# Altium project BEAGLEPLAYV020_220915.PrjPcb (part 7 of 10)

## Sheet 014_SoC GPIO 1.8V & Bootstrap.SchDoc
size 420 x 297 mm; Page Create Date: May 29, 2006; WebSite: https://www.seeedstudio.com; Page Number: 14; Drawing: qxn; Schematic Name: BeaglePlay; Page Size: A3; Comment: Seeed Title; Page Count: 22; Page Name: 014_SoC GPIO 1.8V & Bootstrap; Company: Seeed Studio; RevCode: v0.2; DsnPath: C:\Users\a0488739\Documents\GitHub\beagleplay\allegro\DVT\BEAGLEPLAYV020_220915.DSN; SchematicName: BeaglePlay; PageName: 014_SoC GPIO 1.8V & Bootstrap; PageSize: A3; TopSchematic: True
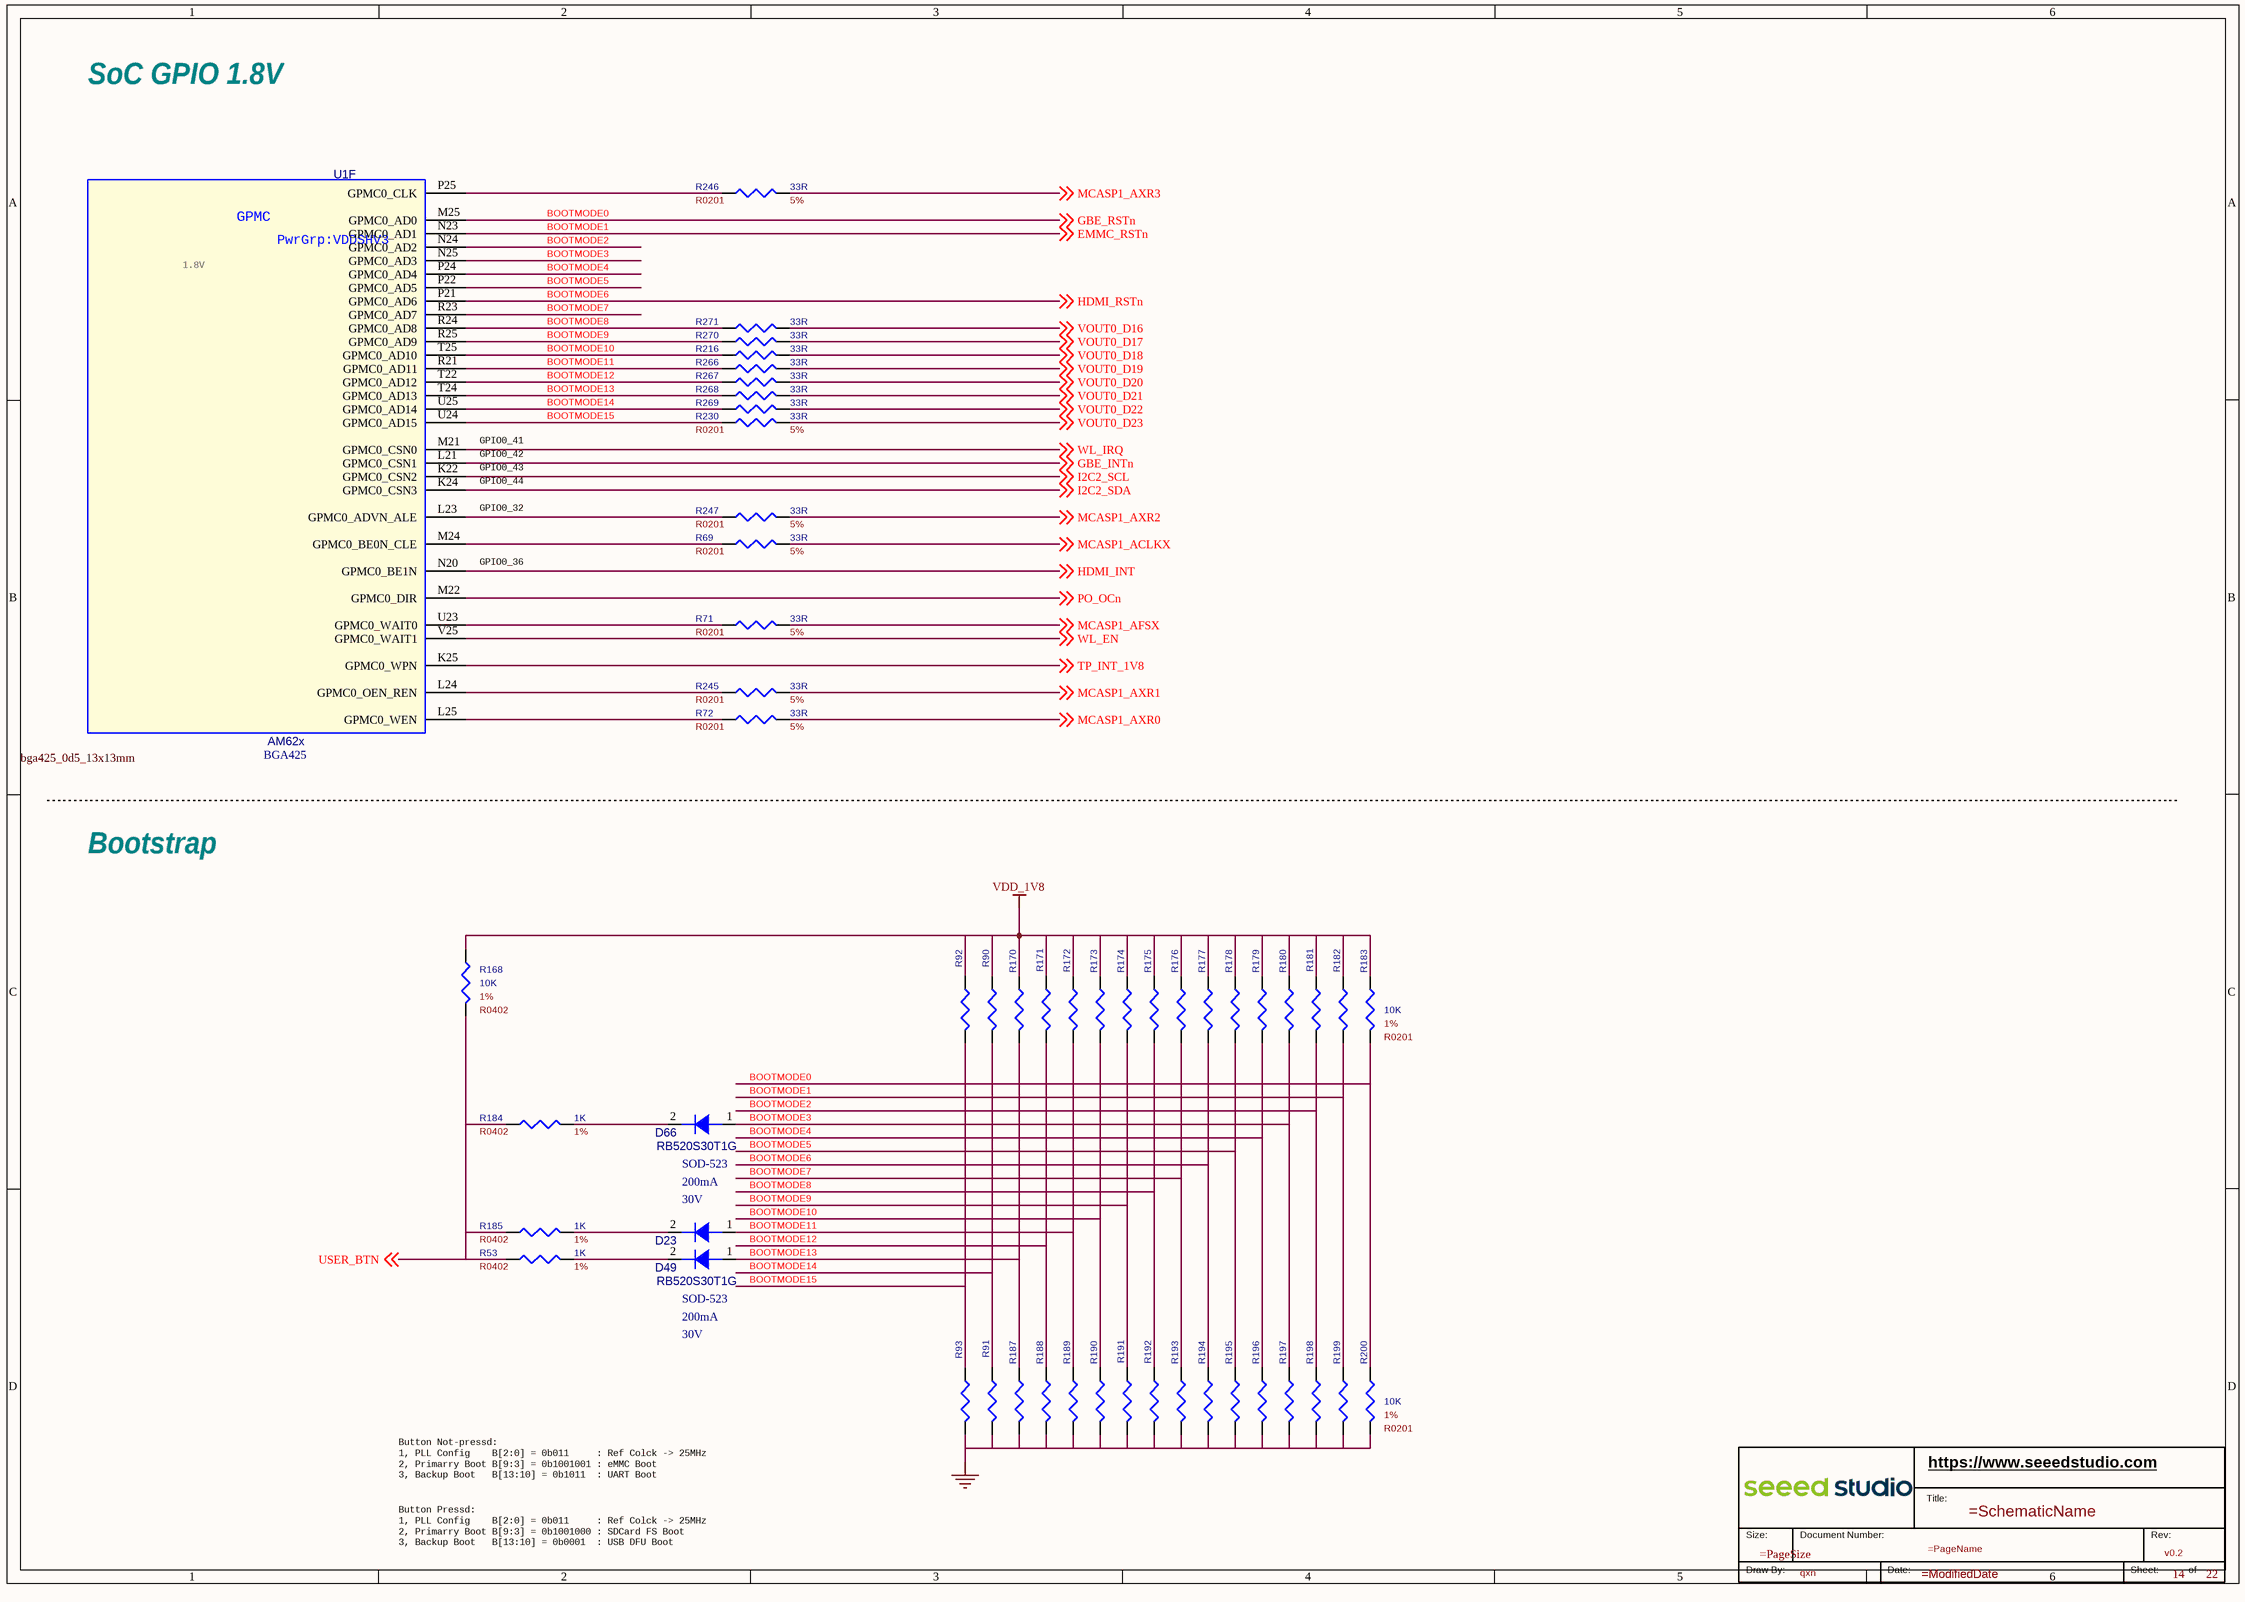
[diagram p13: 014_SoC GPIO 1.8V & Bootstrap.SchDoc]

### Parts
(Parts that share a designator on the sheet are numbered #1, #2 ... from top to bottom, then left to right.)
*#14  RevCode: v0.2  Page Number: 14  Page Count: 22  Drawing: qxn  (hidden comment: Seeed Title)  (graphical)
D23  D  [sod_523]  (value not drawn)
D49  value RB520S30T1G  Repetitive Reverse Voltage Maximum: 30V  Peak Forward Current: 200mA  Package Size: SOD-523  [sod_523]  (hidden comment: D)
D66  value RB520S30T1G  Repetitive Reverse Voltage Maximum: 30V  Peak Forward Current: 200mA  Package Size: SOD-523  [sod_523]  (hidden comment: D)
R53  value 1K  Rating: 1%  [R0402]  (hidden comment: R)
R69  value 33R  Rating: 5%  [R0201]  (hidden comment: R)
R71  value 33R  Rating: 5%  [R0201]  (hidden comment: R)
R72  value 33R  Rating: 5%  [R0201]  (hidden comment: R)
R90  R  [R0201]  (value not drawn)
R91  R  [R0201]  (value not drawn)
R92  R  [R0201]  (value not drawn)
R93  R  [R0201]  (value not drawn)
R168  value 10K  Rating: 1%  [R0402]  (hidden comment: R)
R170  R  [R0201]  (value not drawn)
R171  R  [R0201]  (value not drawn)
R172  R  [R0201]  (value not drawn)
R173  R  [R0201]  (value not drawn)
R174  R  [R0201]  (value not drawn)
R175  R  [R0201]  (value not drawn)
R176  R  [R0201]  (value not drawn)
R177  R  [R0201]  (value not drawn)
R178  R  [R0201]  (value not drawn)
R179  R  [R0201]  (value not drawn)
R180  R  [R0201]  (value not drawn)
R181  R  [R0201]  (value not drawn)
R182  R  [R0201]  (value not drawn)
R183  value 10K  Rating: 1%  [R0201]  (hidden comment: R)
R184  value 1K  Rating: 1%  [R0402]  (hidden comment: R)
R185  value 1K  Rating: 1%  [R0402]  (hidden comment: R)
R187  R  [R0201]  (value not drawn)
R188  R  [R0201]  (value not drawn)
R189  R  [R0201]  (value not drawn)
R190  R  [R0201]  (value not drawn)
R191  R  [R0201]  (value not drawn)
R192  R  [R0201]  (value not drawn)
R193  R  [R0201]  (value not drawn)
R194  R  [R0201]  (value not drawn)
R195  R  [R0201]  (value not drawn)
R196  R  [R0201]  (value not drawn)
R197  R  [R0201]  (value not drawn)
R198  R  [R0201]  (value not drawn)
R199  R  [R0201]  (value not drawn)
R200  value 10K  Rating: 1%  [R0201]  (hidden comment: R)
R216  value 33R  [R0201]  (hidden comment: R)
R230  value 33R  Rating: 5%  [R0201]  (hidden comment: R)
R245  value 33R  Rating: 5%  [R0201]  (hidden comment: R)
R246  value 33R  Rating: 5%  [R0201]  (hidden comment: R)
R247  value 33R  Rating: 5%  [R0201]  (hidden comment: R)
R266  value 33R  [R0201]  (hidden comment: R)
R267  value 33R  [R0201]  (hidden comment: R)
R268  value 33R  [R0201]  (hidden comment: R)
R269  value 33R  [R0201]  (hidden comment: R)
R270  value 33R  [R0201]  (hidden comment: R)
R271  value 33R  [R0201]  (hidden comment: R)
U1  value AM62x  Package Size: BGA425  [bga425_0d5_13x13mm]  (hidden comment: AM62x_BGA425)  (part F of 19)

### Nets
GND: R91.2 R93.2 R187.2 R188.2 R189.2 R190.2 R191.2 R192.2 R193.2 R194.2 R195.2 R196.2 R197.2 R198.2 R199.2 R200.2
VDD_1V8: R90.1 R92.1 R168.1 R170.1 R171.1 R172.1 R173.1 R174.1 R175.1 R176.1 R177.1 R178.1 R179.1 R180.1 R181.1 R182.1 R183.1
BOOTMODE0: R183.2 R200.1 U1.M25(GPMC0_AD0) ; off-sheet GBE_RSTn  [also labelled GBE_RSTn]
BOOTMODE1: R182.2 R199.1 U1.N23(GPMC0_AD1) ; off-sheet EMMC_RSTn  [also labelled EMMC_RSTn]
BOOTMODE2: R181.2 R198.1 U1.N24(GPMC0_AD2)
BOOTMODE3: D66.1(A) R180.2 R197.1 U1.N25(GPMC0_AD3)
BOOTMODE4: R179.2 R196.1 U1.P24(GPMC0_AD4)
BOOTMODE5: R178.2 R195.1 U1.P22(GPMC0_AD5)
BOOTMODE6: R177.2 R194.1 U1.P21(GPMC0_AD6) ; off-sheet HDMI_RSTn  [also labelled HDMI_RSTn]
BOOTMODE7: R176.2 R193.1 U1.R23(GPMC0_AD7)
BOOTMODE8: R175.2 R192.1 R271.1 U1.R24(GPMC0_AD8)
BOOTMODE9: R174.2 R191.1 R270.1 U1.R25(GPMC0_AD9)
BOOTMODE10: R173.2 R190.1 R216.1 U1.T25(GPMC0_AD10)
BOOTMODE11: D23.1(A) R172.2 R189.1 R266.1 U1.R21(GPMC0_AD11)
BOOTMODE12: R171.2 R188.1 R267.1 U1.T22(GPMC0_AD12)
BOOTMODE13: D49.1(A) R170.2 R187.1 R268.1 U1.T24(GPMC0_AD13)
BOOTMODE14: R90.2 R91.1 R269.1 U1.U25(GPMC0_AD14)
BOOTMODE15: R92.2 R93.1 R230.1 U1.U24(GPMC0_AD15)
GBE_INTn: U1.L21(GPMC0_CSN1) ; off-sheet GBE_INTn
HDMI_INT: U1.N20(GPMC0_BE1N) ; off-sheet HDMI_INT
I2C2_SCL: U1.K22(GPMC0_CSN2) ; off-sheet I2C2_SCL
I2C2_SDA: U1.K24(GPMC0_CSN3) ; off-sheet I2C2_SDA
MCASP1_ACLKX: R69.2 ; off-sheet MCASP1_ACLKX
MCASP1_AFSX: R71.2 ; off-sheet MCASP1_AFSX
MCASP1_AXR0: R72.2 ; off-sheet MCASP1_AXR0
MCASP1_AXR1: R245.2 ; off-sheet MCASP1_AXR1
MCASP1_AXR2: R247.2 ; off-sheet MCASP1_AXR2
MCASP1_AXR3: R246.2 ; off-sheet MCASP1_AXR3
PO_OCn: U1.M22(GPMC0_DIR) ; off-sheet PO_OCn
TP_INT_1V8: U1.K25(GPMC0_WPN) ; off-sheet TP_INT_1V8
USER_BTN: R53.1 R168.2 R184.1 R185.1 ; off-sheet USER_BTN
VOUT0_D16: R271.2 ; off-sheet VOUT0_D16
VOUT0_D17: R270.2 ; off-sheet VOUT0_D17
VOUT0_D18: R216.2 ; off-sheet VOUT0_D18
VOUT0_D19: R266.2 ; off-sheet VOUT0_D19
VOUT0_D20: R267.2 ; off-sheet VOUT0_D20
VOUT0_D21: R268.2 ; off-sheet VOUT0_D21
VOUT0_D22: R269.2 ; off-sheet VOUT0_D22
VOUT0_D23: R230.2 ; off-sheet VOUT0_D23
WL_EN: U1.V25(GPMC0_WAIT1) ; off-sheet WL_EN
WL_IRQ: U1.M21(GPMC0_CSN0) ; off-sheet WL_IRQ
NetD23_2: D23.2(C) R185.2
NetD49_2: D49.2(C) R53.2
NetD66_2: D66.2(C) R184.2
NetR69_1: R69.1 U1.M24(GPMC0_BE0N_CLE)
NetR71_1: R71.1 U1.U23(GPMC0_WAIT0)
NetR72_1: R72.1 U1.L25(GPMC0_WEN)
NetR245_1: R245.1 U1.L24(GPMC0_OEN_REN)
NetR246_1: R246.1 U1.P25(GPMC0_CLK)
NetR247_1: R247.1 U1.L23(GPMC0_ADVN_ALE)

### Notes on the sheet
- SoC GPIO 1.8V
- 1.8V
- GPIO0_42
- GPIO0_41
- GPIO0_43
- GPIO0_44
- GPIO0_32
- GPIO0_36
- Bootstrap
- Button Not-pressd:
  1, PLL Config    B[2:0] = 0b011     : Ref Colck -> 25MHz
  2, Primarry Boot B[9:3] = 0b1001001 : eMMC Boot
  3, Backup Boot   B[13:10] = 0b1011  : UART Boot
- Button Pressd:
  1, PLL Config    B[2:0] = 0b011     : Ref Colck -> 25MHz
  2, Primarry Boot B[9:3] = 0b1001000 : SDCard FS Boot
  3, Backup Boot   B[13:10] = 0b0001  : USB DFU Boot
- (in symbol AM62x_BGA425, part F) GPMC; PwrGrp:VDDSHV3
- (in symbol Seeed Title) https://www.seeedstudio.com; Title:; Size:; Document Number:; Rev:; Draw By:; Date:; Sheet:; of

### Library data of the parts
*#14 = Seeed Title: Company: Seeed Studio; WebSite: https://www.seeedstudio.com; Schematic Name: =SchematicName; Page Size: =PageSize; Page Name: =PageName; Page Create Date: May 29, 2006; Page Modify Date: =ModifiedDate
D23 = D: DIO, Schottky, RB520S30T1G, , , , SOD-523; Part Reference: D23; Company Part Status: SCG Vehicle Device; Manufacturer: ON; PN: 304020782; Peak Forward Current: 200mA; Repetitive Reverse Voltage Maximum: 30V; CLASS: DISCRETE; PCB Footprint: sod_523; Value: RB520S30T1G; Package Size: SOD-523; Manufacturer PN: RB520S30T1G
D49 = D: DIO, Schottky, RB520S30T1G, , , , SOD-523; Part Reference: D49; Manufacturer: ON; Company Part Status: SCG Vehicle Device; CLASS: DISCRETE; PN: 304020782; PCB Footprint: sod_523; Manufacturer PN: RB520S30T1G
D66 = D: DIO, Schottky, RB520S30T1G, , , , SOD-523; Part Reference: D66; Manufacturer: ON; Company Part Status: SCG Vehicle Device; CLASS: DISCRETE; PN: 304020782; PCB Footprint: sod_523; Manufacturer PN: RB520S30T1G
R53 = R: RES, Thick Film, 1K, 1%, 1/16W, SMD, 0402; Part Reference: R53; Manufacturer PN: RC0402FR-071KL; Manufacturer: YAGEO; Company Part Status: Combox Pro; CLASS: DISCRETE; PN: 301010044; PCB Footprint: R0402; Rated Power: 1/16W; Package Size: 0402
R69 = R: RES, Thick Film, 33R, 5%, 1/20W, SMD, 0201; Part Reference: R69; Manufacturer PN: RC0201JR-0733RL; Manufacturer: YAGEO; Company Part Status: BeagleBone Carrier Board; CLASS: DISCRETE; PN: 301010675; PCB Footprint: R0201; Rated Power: 1/20W; Package Size: 0201
R71 = R: RES, Thick Film, 33R, 5%, 1/20W, SMD, 0201; Part Reference: R71; Manufacturer PN: RC0201JR-0733RL; Manufacturer: YAGEO; Company Part Status: BeagleBone Carrier Board; CLASS: DISCRETE; PN: 301010675; PCB Footprint: R0201; Rated Power: 1/20W; Package Size: 0201
R72 = R: RES, Thick Film, 33R, 5%, 1/20W, SMD, 0201; Part Reference: R72; Manufacturer PN: RC0201JR-0733RL; Manufacturer: YAGEO; Company Part Status: BeagleBone Carrier Board; CLASS: DISCRETE; PN: 301010675; PCB Footprint: R0201; Rated Power: 1/20W; Package Size: 0201
R90 = R: RES, Thick Film, 10K, 1%, 1/20W, SMD, 0201; Part Reference: R90; Manufacturer PN: RC0201FR-0710KL; Manufacturer: YAGEO; Company Part Status: RV PI; CLASS: DISCRETE; PN: 301010526; Rating: 1%; PCB Footprint: R0201; Value: 10K; Package Size: 0201; Rated Power: 1/20W
R91 = R: RES, Thick Film, 10K, 1%, 1/20W, SMD, 0201; Part Reference: R91; Company Part Status: RV PI; Manufacturer: YAGEO; Manufacturer PN: RC0201FR-0710KL; PN: 301010526; CLASS: DISCRETE; Rating: 1%; PCB Footprint: R0201; Value: 10K; Package Size: 0201; Rated Power: 1/20W
R92 = R: RES, Thick Film, 10K, 1%, 1/20W, SMD, 0201; Part Reference: R92; Company Part Status: RV PI; Manufacturer: YAGEO; Manufacturer PN: RC0201FR-0710KL; PN: 301010526; CLASS: DISCRETE; Rating: 1%; PCB Footprint: R0201; Value: 10K; Rated Power: 1/20W; Package Size: 0201
R93 = R: RES, Thick Film, 10K, 1%, 1/20W, SMD, 0201; Part Reference: R93; Manufacturer PN: RC0201FR-0710KL; Manufacturer: YAGEO; Company Part Status: RV PI; CLASS: DISCRETE; PN: 301010526; Rating: 1%; PCB Footprint: R0201; Value: 10K; Rated Power: 1/20W; Package Size: 0201
R168 = R: RES, Thick Film, 10K, 1%, 1/16W, SMD, 0402; Part Reference: R168; Company Part Status: BeagleBone Carrier Board; Manufacturer: YAGEO; Manufacturer PN: RC0402FR-0710KL; PN: 301010047; CLASS: DISCRETE; PCB Footprint: R0402; Package Size: 0402; Rated Power: 1/16W
R170 = R: RES, Thick Film, 10K, 1%, 1/20W, SMD, 0201; Part Reference: R170; Manufacturer PN: RC0201FR-0710KL; Manufacturer: YAGEO; Company Part Status: RV PI; CLASS: DISCRETE; PN: 301010526; Rating: 1%; PCB Footprint: R0201; Value: 10K; Package Size: 0201; Rated Power: 1/20W
R171 = R: RES, Thick Film, 10K, 1%, 1/20W, SMD, 0201; Part Reference: R171; Manufacturer PN: RC0201FR-0710KL; Manufacturer: YAGEO; Company Part Status: RV PI; CLASS: DISCRETE; PN: 301010526; Rating: 1%; PCB Footprint: R0201; Value: 10K; Package Size: 0201; Rated Power: 1/20W
R172 = R: RES, Thick Film, 10K, 1%, 1/20W, SMD, 0201; Part Reference: R172; Manufacturer PN: RC0201FR-0710KL; Manufacturer: YAGEO; Company Part Status: RV PI; CLASS: DISCRETE; PN: 301010526; Rating: 1%; PCB Footprint: R0201; Value: 10K; Package Size: 0201; Rated Power: 1/20W
R173 = R: RES, Thick Film, 10K, 1%, 1/20W, SMD, 0201; Part Reference: R173; Manufacturer PN: RC0201FR-0710KL; Manufacturer: YAGEO; Company Part Status: RV PI; CLASS: DISCRETE; PN: 301010526; Rating: 1%; PCB Footprint: R0201; Value: 10K; Package Size: 0201; Rated Power: 1/20W
R174 = R: RES, Thick Film, 10K, 1%, 1/20W, SMD, 0201; Part Reference: R174; Manufacturer PN: RC0201FR-0710KL; Manufacturer: YAGEO; Company Part Status: RV PI; CLASS: DISCRETE; PN: 301010526; Rating: 1%; PCB Footprint: R0201; Value: 10K; Package Size: 0201; Rated Power: 1/20W
R175 = R: RES, Thick Film, 10K, 1%, 1/20W, SMD, 0201; Part Reference: R175; Manufacturer PN: RC0201FR-0710KL; Manufacturer: YAGEO; Company Part Status: RV PI; CLASS: DISCRETE; PN: 301010526; Rating: 1%; PCB Footprint: R0201; Value: 10K; Package Size: 0201; Rated Power: 1/20W
R176 = R: RES, Thick Film, 10K, 1%, 1/20W, SMD, 0201; Part Reference: R176; Manufacturer PN: RC0201FR-0710KL; Manufacturer: YAGEO; Company Part Status: RV PI; CLASS: DISCRETE; PN: 301010526; Rating: 1%; PCB Footprint: R0201; Value: 10K; Package Size: 0201; Rated Power: 1/20W
R177 = R: RES, Thick Film, 10K, 1%, 1/20W, SMD, 0201; Part Reference: R177; Manufacturer PN: RC0201FR-0710KL; Manufacturer: YAGEO; Company Part Status: RV PI; CLASS: DISCRETE; PN: 301010526; Rating: 1%; PCB Footprint: R0201; Value: 10K; Package Size: 0201; Rated Power: 1/20W
R178 = R: RES, Thick Film, 10K, 1%, 1/20W, SMD, 0201; Part Reference: R178; Manufacturer PN: RC0201FR-0710KL; Manufacturer: YAGEO; Company Part Status: RV PI; CLASS: DISCRETE; PN: 301010526; Rating: 1%; PCB Footprint: R0201; Value: 10K; Package Size: 0201; Rated Power: 1/20W
R179 = R: RES, Thick Film, 10K, 1%, 1/20W, SMD, 0201; Part Reference: R179; Manufacturer PN: RC0201FR-0710KL; Manufacturer: YAGEO; Company Part Status: RV PI; CLASS: DISCRETE; PN: 301010526; Rating: 1%; PCB Footprint: R0201; Value: 10K; Package Size: 0201; Rated Power: 1/20W
R180 = R: RES, Thick Film, 10K, 1%, 1/20W, SMD, 0201; Part Reference: R180; Manufacturer PN: RC0201FR-0710KL; Manufacturer: YAGEO; Company Part Status: RV PI; CLASS: DISCRETE; PN: 301010526; Rating: 1%; PCB Footprint: R0201; Value: 10K; Package Size: 0201; Rated Power: 1/20W
R181 = R: RES, Thick Film, 10K, 1%, 1/20W, SMD, 0201; Part Reference: R181; Manufacturer PN: RC0201FR-0710KL; Manufacturer: YAGEO; Company Part Status: RV PI; CLASS: DISCRETE; PN: 301010526; Rating: 1%; PCB Footprint: R0201; Value: 10K; Package Size: 0201; Rated Power: 1/20W
R182 = R: RES, Thick Film, 10K, 1%, 1/20W, SMD, 0201; Part Reference: R182; Manufacturer PN: RC0201FR-0710KL; Manufacturer: YAGEO; Company Part Status: RV PI; CLASS: DISCRETE; PN: 301010526; Rating: 1%; PCB Footprint: R0201; Value: 10K; Package Size: 0201; Rated Power: 1/20W
R183 = R: RES, Thick Film, 10K, 1%, 1/20W, SMD, 0201; Part Reference: R183; Company Part Status: RV PI; Manufacturer: YAGEO; Manufacturer PN: RC0201FR-0710KL; PN: 301010526; CLASS: DISCRETE; PCB Footprint: R0201; Package Size: 0201; Rated Power: 1/20W
R184 = R: RES, Thick Film, 1K, 1%, 1/16W, SMD, 0402; Part Reference: R184; Manufacturer PN: RC0402FR-071KL; Manufacturer: YAGEO; Company Part Status: Combox Pro; CLASS: DISCRETE; PN: 301010044; PCB Footprint: R0402; Rated Power: 1/16W; Package Size: 0402
R185 = R: RES, Thick Film, 1K, 1%, 1/16W, SMD, 0402; Part Reference: R185; Manufacturer PN: RC0402FR-071KL; Manufacturer: YAGEO; Company Part Status: Combox Pro; CLASS: DISCRETE; PN: 301010044; PCB Footprint: R0402; Rated Power: 1/16W; Package Size: 0402
R187 = R: RES, Thick Film, 10K, 1%, 1/20W, SMD, 0201; Part Reference: R187; Company Part Status: RV PI; Manufacturer: YAGEO; Manufacturer PN: RC0201FR-0710KL; PN: 301010526; CLASS: DISCRETE; Rating: 1%; PCB Footprint: R0201; Value: 10K; Package Size: 0201; Rated Power: 1/20W
R188 = R: RES, Thick Film, 10K, 1%, 1/20W, SMD, 0201; Part Reference: R188; Company Part Status: RV PI; Manufacturer: YAGEO; Manufacturer PN: RC0201FR-0710KL; PN: 301010526; CLASS: DISCRETE; Rating: 1%; PCB Footprint: R0201; Value: 10K; Package Size: 0201; Rated Power: 1/20W
R189 = R: RES, Thick Film, 10K, 1%, 1/20W, SMD, 0201; Part Reference: R189; Company Part Status: RV PI; Manufacturer: YAGEO; Manufacturer PN: RC0201FR-0710KL; PN: 301010526; CLASS: DISCRETE; Rating: 1%; PCB Footprint: R0201; Value: 10K; Package Size: 0201; Rated Power: 1/20W
R190 = R: RES, Thick Film, 10K, 1%, 1/20W, SMD, 0201; Part Reference: R190; Company Part Status: RV PI; Manufacturer: YAGEO; Manufacturer PN: RC0201FR-0710KL; PN: 301010526; CLASS: DISCRETE; Rating: 1%; PCB Footprint: R0201; Value: 10K; Package Size: 0201; Rated Power: 1/20W
R191 = R: RES, Thick Film, 10K, 1%, 1/20W, SMD, 0201; Part Reference: R191; Company Part Status: RV PI; Manufacturer: YAGEO; Manufacturer PN: RC0201FR-0710KL; PN: 301010526; CLASS: DISCRETE; Rating: 1%; PCB Footprint: R0201; Value: 10K; Package Size: 0201; Rated Power: 1/20W
R192 = R: RES, Thick Film, 10K, 1%, 1/20W, SMD, 0201; Part Reference: R192; Company Part Status: RV PI; Manufacturer: YAGEO; Manufacturer PN: RC0201FR-0710KL; PN: 301010526; CLASS: DISCRETE; Rating: 1%; PCB Footprint: R0201; Value: 10K; Package Size: 0201; Rated Power: 1/20W
R193 = R: RES, Thick Film, 10K, 1%, 1/20W, SMD, 0201; Part Reference: R193; Company Part Status: RV PI; Manufacturer: YAGEO; Manufacturer PN: RC0201FR-0710KL; PN: 301010526; CLASS: DISCRETE; Rating: 1%; PCB Footprint: R0201; Value: 10K; Package Size: 0201; Rated Power: 1/20W
R194 = R: RES, Thick Film, 10K, 1%, 1/20W, SMD, 0201; Part Reference: R194; Company Part Status: RV PI; Manufacturer: YAGEO; Manufacturer PN: RC0201FR-0710KL; PN: 301010526; CLASS: DISCRETE; Rating: 1%; PCB Footprint: R0201; Value: 10K; Package Size: 0201; Rated Power: 1/20W
R195 = R: RES, Thick Film, 10K, 1%, 1/20W, SMD, 0201; Part Reference: R195; Company Part Status: RV PI; Manufacturer: YAGEO; Manufacturer PN: RC0201FR-0710KL; PN: 301010526; CLASS: DISCRETE; Rating: 1%; PCB Footprint: R0201; Value: 10K; Package Size: 0201; Rated Power: 1/20W
R196 = R: RES, Thick Film, 10K, 1%, 1/20W, SMD, 0201; Part Reference: R196; Company Part Status: RV PI; Manufacturer: YAGEO; Manufacturer PN: RC0201FR-0710KL; PN: 301010526; CLASS: DISCRETE; Rating: 1%; PCB Footprint: R0201; Value: 10K; Package Size: 0201; Rated Power: 1/20W
R197 = R: RES, Thick Film, 10K, 1%, 1/20W, SMD, 0201; Part Reference: R197; Company Part Status: RV PI; Manufacturer: YAGEO; Manufacturer PN: RC0201FR-0710KL; PN: 301010526; CLASS: DISCRETE; Rating: 1%; PCB Footprint: R0201; Value: 10K; Package Size: 0201; Rated Power: 1/20W
R198 = R: RES, Thick Film, 10K, 1%, 1/20W, SMD, 0201; Part Reference: R198; Company Part Status: RV PI; Manufacturer: YAGEO; Manufacturer PN: RC0201FR-0710KL; PN: 301010526; CLASS: DISCRETE; Rating: 1%; PCB Footprint: R0201; Value: 10K; Package Size: 0201; Rated Power: 1/20W
R199 = R: RES, Thick Film, 10K, 1%, 1/20W, SMD, 0201; Part Reference: R199; Company Part Status: RV PI; Manufacturer: YAGEO; Manufacturer PN: RC0201FR-0710KL; PN: 301010526; CLASS: DISCRETE; Rating: 1%; PCB Footprint: R0201; Value: 10K; Package Size: 0201; Rated Power: 1/20W
R200 = R: RES, Thick Film, 10K, 1%, 1/20W, SMD, 0201; Part Reference: R200; Manufacturer PN: RC0201FR-0710KL; Manufacturer: YAGEO; Company Part Status: RV PI; CLASS: DISCRETE; PN: 301010526; PCB Footprint: R0201; Package Size: 0201; Rated Power: 1/20W
R216 = R: RES, Thick Film, 33R, 5%, 1/20W, SMD, 0201; Part Reference: R216; Manufacturer PN: RC0201JR-0733RL; Manufacturer: YAGEO; Company Part Status: BeagleBone Carrier Board; CLASS: DISCRETE; PN: 301010675; Rating: 5%; PCB Footprint: R0201; Rated Power: 1/20W; Package Size: 0201
R230 = R: RES, Thick Film, 33R, 5%, 1/20W, SMD, 0201; Part Reference: R230; Manufacturer PN: RC0201JR-0733RL; Manufacturer: YAGEO; Company Part Status: BeagleBone Carrier Board; CLASS: DISCRETE; PN: 301010675; PCB Footprint: R0201; Rated Power: 1/20W; Package Size: 0201
R245 = R: RES, Thick Film, 33R, 5%, 1/20W, SMD, 0201; Part Reference: R245; Manufacturer PN: RC0201JR-0733RL; Manufacturer: YAGEO; Company Part Status: BeagleBone Carrier Board; CLASS: DISCRETE; PN: 301010675; PCB Footprint: R0201; Rated Power: 1/20W; Package Size: 0201
R246 = R: RES, Thick Film, 33R, 5%, 1/20W, SMD, 0201; Part Reference: R246; Manufacturer PN: RC0201JR-0733RL; Manufacturer: YAGEO; Company Part Status: BeagleBone Carrier Board; CLASS: DISCRETE; PN: 301010675; PCB Footprint: R0201; Rated Power: 1/20W; Package Size: 0201
R247 = R: RES, Thick Film, 33R, 5%, 1/20W, SMD, 0201; Part Reference: R247; Manufacturer PN: RC0201JR-0733RL; Manufacturer: YAGEO; Company Part Status: BeagleBone Carrier Board; CLASS: DISCRETE; PN: 301010675; PCB Footprint: R0201; Rated Power: 1/20W; Package Size: 0201
R266 = R: RES, Thick Film, 33R, 5%, 1/20W, SMD, 0201; Part Reference: R266; Manufacturer PN: RC0201JR-0733RL; Manufacturer: YAGEO; Company Part Status: BeagleBone Carrier Board; CLASS: DISCRETE; PN: 301010675; Rating: 5%; PCB Footprint: R0201; Rated Power: 1/20W; Package Size: 0201
R267 = R: RES, Thick Film, 33R, 5%, 1/20W, SMD, 0201; Part Reference: R267; Manufacturer PN: RC0201JR-0733RL; Manufacturer: YAGEO; Company Part Status: BeagleBone Carrier Board; CLASS: DISCRETE; PN: 301010675; Rating: 5%; PCB Footprint: R0201; Rated Power: 1/20W; Package Size: 0201
R268 = R: RES, Thick Film, 33R, 5%, 1/20W, SMD, 0201; Part Reference: R268; Manufacturer PN: RC0201JR-0733RL; Manufacturer: YAGEO; Company Part Status: BeagleBone Carrier Board; CLASS: DISCRETE; PN: 301010675; Rating: 5%; PCB Footprint: R0201; Rated Power: 1/20W; Package Size: 0201
R269 = R: RES, Thick Film, 33R, 5%, 1/20W, SMD, 0201; Part Reference: R269; Manufacturer PN: RC0201JR-0733RL; Manufacturer: YAGEO; Company Part Status: BeagleBone Carrier Board; CLASS: DISCRETE; PN: 301010675; Rating: 5%; PCB Footprint: R0201; Rated Power: 1/20W; Package Size: 0201
R270 = R: RES, Thick Film, 33R, 5%, 1/20W, SMD, 0201; Part Reference: R270; Manufacturer PN: RC0201JR-0733RL; Manufacturer: YAGEO; Company Part Status: BeagleBone Carrier Board; CLASS: DISCRETE; PN: 301010675; Rating: 5%; PCB Footprint: R0201; Rated Power: 1/20W; Package Size: 0201
R271 = R: RES, Thick Film, 33R, 5%, 1/20W, SMD, 0201; Part Reference: R271; Manufacturer PN: RC0201JR-0733RL; Manufacturer: YAGEO; Company Part Status: BeagleBone Carrier Board; CLASS: DISCRETE; PN: 301010675; Rating: 5%; PCB Footprint: R0201; Rated Power: 1/20W; Package Size: 0201
U1 = AM62x_BGA425: IC, Controller, MPU, AM62x, BGA425; Part Reference: U1; Company Part Status: BeaglePlay; Manufacturer: TI; Manufacturer PN: AM6254ATCGGHALWR; PN: 310011537; PCB Footprint: bga425_0d5_13x13mm; CLASS: IC

## Sheet 015_SoC USB & USB_A & USB_C.SchDoc
size 420 x 297 mm; Page Create Date: May 29, 2006; WebSite: https://www.seeedstudio.com; Variant Name: <Core Design>; Page Number: 15; Drawing: qxn; Schematic Name: BeaglePlay; Page Size: A3; Comment: Seeed Title; Page Count: 22; Page Name: 015_SoC USB & USB_A & USB_C; Company: Seeed Studio; RevCode: v0.2; DsnPath: C:\Users\a0488739\Documents\GitHub\beagleplay\allegro\DVT\BEAGLEPLAYV020_220915.DSN; SchematicName: BeaglePlay; PageName: 015_SoC USB & USB_A & USB_C; PageSize: A3; TopSchematic: True
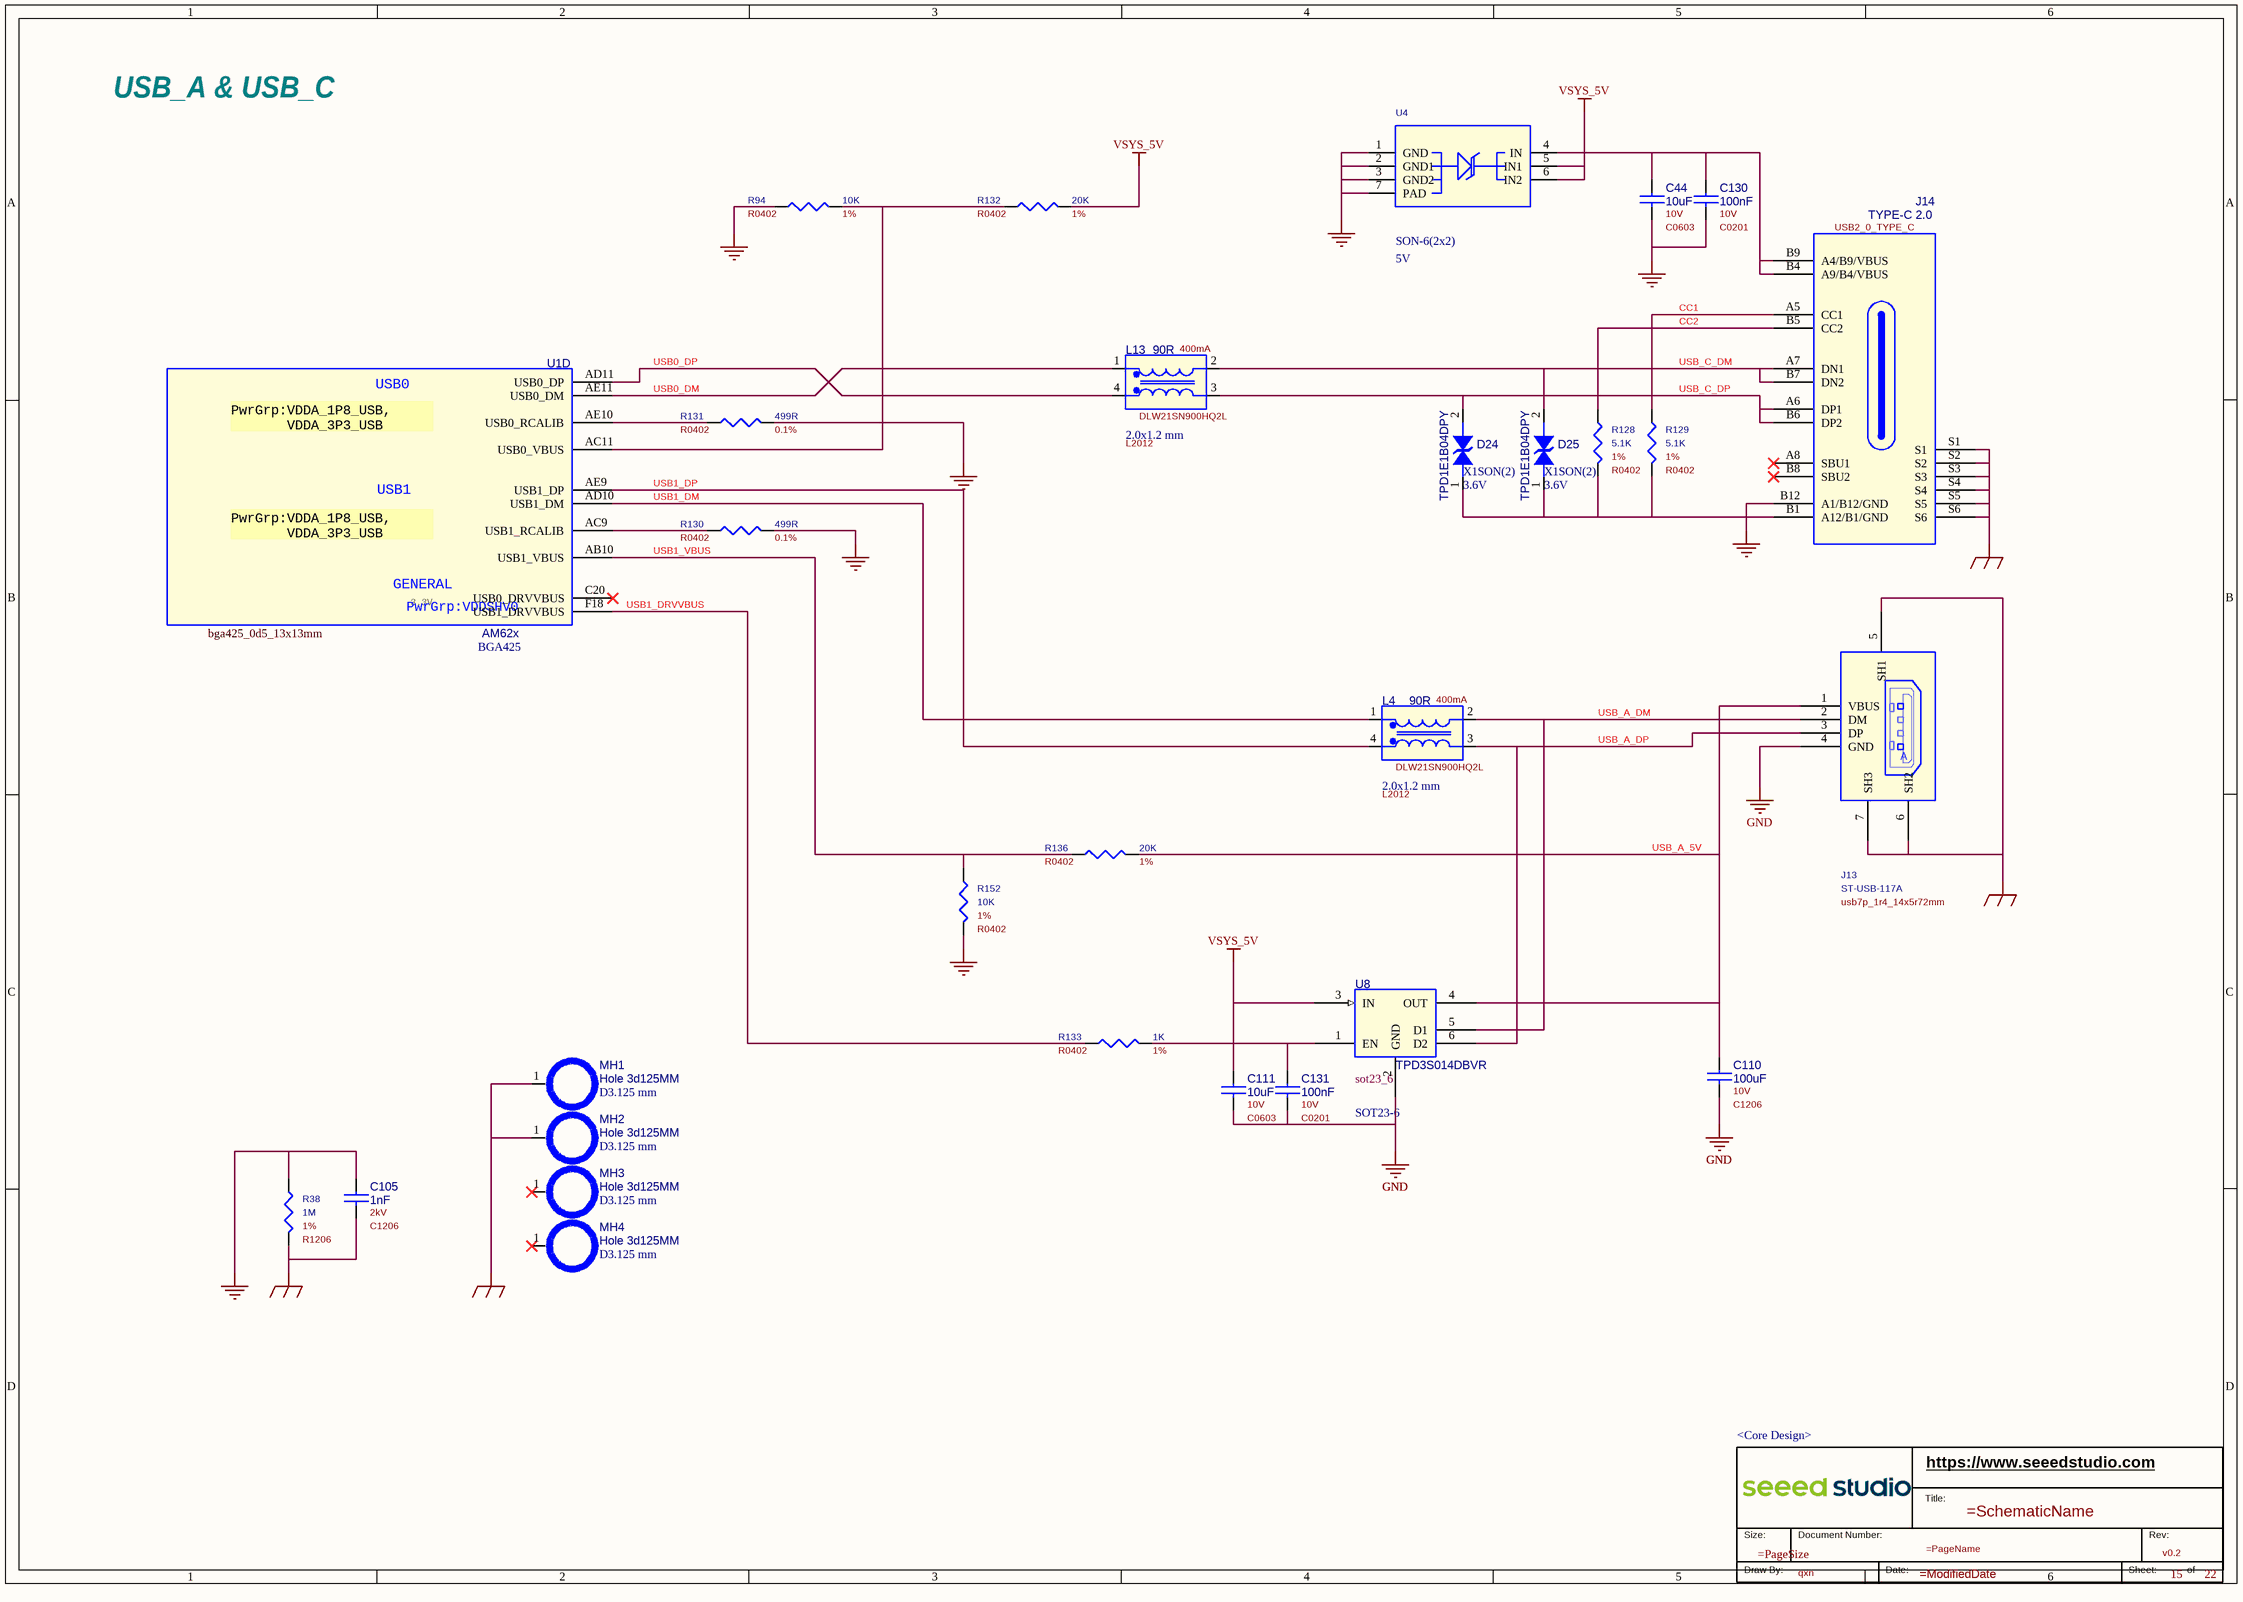
[diagram p14: 015_SoC USB & USB_A & USB_C.SchDoc]

### Parts
(Parts that share a designator on the sheet are numbered #1, #2 ... from top to bottom, then left to right.)
*#15  RevCode: v0.2  Page Number: 15  Page Count: 22  Drawing: qxn  Variant Name: <Core Design>  (hidden comment: Seeed Title)  (graphical)
C44  value 10uF  Rating: 10V  [C0603]  (hidden comment: CC)
C105  value 1nF  Rating: 2kV  [C1206]  (hidden comment: CC)
C110  value 100uF  Rating: 10V  [C1206]  (hidden comment: CC)
C111  value 10uF  Rating: 10V  [C0603]  (hidden comment: CC)
C130  value 100nF  Rating: 10V  [C0201]  (hidden comment: CC)
C131  value 100nF  Rating: 10V  [C0201]  (hidden comment: CC)
D24  value TPD1E1B04DPY  Package Size: X1SON(2)  Rated Voltage: 3.6V  [D0402]  (hidden comment: DIODE TVS BI-DIR)
D25  value TPD1E1B04DPY  Package Size: X1SON(2)  Rated Voltage: 3.6V  [D0402]  (hidden comment: DIODE TVS BI-DIR)
J13  value ST-USB-117A  PCB Footprint: usb7p_1r4_14x5r72mm  [CON_USBDUAL72309]  (hidden comment: Single USB A_180D)
J14  value TYPE-C 2.0  [USB2_0_TYPE_C]  (hidden comment: USB2.0_Type C_16+6P#1)
L4  value 90R  Manufacturer Part Number: DLW21SN900HQ2L  Rating: 400mA  Package Size: 2.0x1.2 mm  [L2012]  (hidden comment: CL)
L13  value 90R  Manufacturer Part Number: DLW21SN900HQ2L  Rating: 400mA  Package Size: 2.0x1.2 mm  [L2012]  (hidden comment: CL)
MH1  value Hole 3d125MM  Package Size: D3.125 mm  [PTH_3_125mm_5]  (hidden comment: MHole)
MH2  value Hole 3d125MM  Package Size: D3.125 mm  [PTH_3_125mm_5]  (hidden comment: MHole)
MH3  value Hole 3d125MM  Package Size: D3.125 mm  [PTH_3_125mm_5]  (hidden comment: MHole)
MH4  value Hole 3d125MM  Package Size: D3.125 mm  [PTH_3_125mm_5]  (hidden comment: MHole)
R38  value 1M  Rating: 1%  [R1206]  (hidden comment: R)
R94  value 10K  Rating: 1%  [R0402]  (hidden comment: R)
R128  value 5.1K  Rating: 1%  [R0402]  (hidden comment: R)
R129  value 5.1K  Rating: 1%  [R0402]  (hidden comment: R)
R130  value 499R  Rating: 0.1%  [R0402]  (hidden comment: R)
R131  value 499R  Rating: 0.1%  [R0402]  (hidden comment: R)
R132  value 20K  Rating: 1%  [R0402]  (hidden comment: R)
R133  value 1K  Rating: 1%  [R0402]  (hidden comment: R)
R136  value 20K  Rating: 1%  [R0402]  (hidden comment: R)
R152  value 10K  Rating: 1%  [R0402]  (hidden comment: R)
U1  value AM62x  Package Size: BGA425  [bga425_0d5_13x13mm]  (hidden comment: AM62x_BGA425)  (part D of 19)
U4  Package Size: SON-6(2x2)  Rated Voltage: 5V  [WSON6_0d65_2x2x0_8mm]  (hidden comment: TVS0500DRVR)
U8  value TPD3S014DBVR  Package Size: SOT23-6  [sot23_6]  (hidden comment: TPD3S014D_SOT23-6)

### Nets
GND: C44.2 C105.1 C110.2 C111.2 C130.2 C131.2 D24.1 D25.1 J13.4(GND) J14.B1(A12/B1/GND) J14.B12(A1/B12/GND) R38.1 R94.1 R128.2 R129.2 R130.2 R131.2 R152.2 U4.1(GND) U4.2(GND1) U4.3(GND2) U4.7(PAD) U8.2(GND)
GND_EARTH: C105.2 J13.5(SH1) J13.6(SH2) J13.7(SH3) J14.S1 J14.S2 J14.S3 J14.S4 J14.S5 J14.S6 MH1.1(NC) MH2.1(NC) R38.2
VSYS_5V: C44.1 C111.1 C130.1 J14.B4(A9/B4/VBUS) J14.B9(A4/B9/VBUS) R132.2 U4.4(IN) U4.5(IN1) U4.6(IN2) U8.3(IN)
CC1: J14.A5(CC1) R129.1
CC2: J14.B5(CC2) R128.1
USB0_DM: L13.1 U1.AE11(USB0_DM)
USB0_DP: L13.4 U1.AD11(USB0_DP)
USB1_DM: L4.1 U1.AD10(USB1_DM)
USB1_DP: L4.4 U1.AE9(USB1_DP)
USB1_DRVVBUS: R133.1 U1.F18(USB1_DRVVBUS)
USB1_VBUS: R136.1 R152.1 U1.AB10(USB1_VBUS)
USB_A_5V: C110.1 J13.1(VBUS) R136.2 U8.4(OUT)
USB_A_DM: J13.2(DM) L4.2 U8.5(D1)
USB_A_DP: J13.3(DP) L4.3 U8.6(D2)
USB_C_DM: D25.2 J14.A7(DN1) J14.B7(DN2) L13.2
USB_C_DP: D24.2 J14.A6(DP1) J14.B6(DP2) L13.3
NetC131_1: C131.1 R133.2 U8.1(EN)
NetR94_2: R94.2 R132.1 U1.AC11(USB0_VBUS)
NetR130_1: R130.1 U1.AC9(USB1_RCALIB)
NetR131_1: R131.1 U1.AE10(USB0_RCALIB)

Not connected (* = marked no-connect by the designer): J14 A8(SBU1)* B8(SBU2)*; MH3 1(NC)*; MH4 1(NC)*; U1 C20(USB0_DRVVBUS)*

### Notes on the sheet
- USB_A & USB_C
- 3.3V
- (in symbol AM62x_BGA425, part D) USB0; PwrGrp:VDDA_1P8_USB, / VDDA_3P3_USB; USB1; GENERAL; PwrGrp:VDDSHV0
- (in symbol Seeed Title) https://www.seeedstudio.com; Title:; Size:; Document Number:; Rev:; Draw By:; Date:; Sheet:; of
- (in symbol Single USB A_180D) A

### Library data of the parts
*#15 = Seeed Title: Company: Seeed Studio; WebSite: https://www.seeedstudio.com; Schematic Name: =SchematicName; Page Size: =PageSize; Page Name: =PageName; Page Create Date: May 29, 2006; Page Modify Date: =ModifiedDate
C44 = CC: CAP, Ceramic, SMD, 10uF, 10%, 10V, 0603; Part Reference: C44; Manufacturer PN: CC0603KRX5R6BB106; Manufacturer: YAGEO; Company Part Status: BeagleBone Carrier Board; CLASS: DISCRETE; Temperature Coefficient: X5R; PN: 302010103; PCB Footprint: C0603; Tolerance: 10%; Dielectric Type: Ceramic; Package Size: 0603
C105 = CC: CAP, Ceramic, SMD, 1nF, 10%, 2kV, 1206; Part Reference: C105; Company Part Status: BeagleBone Carrier Board; Manufacturer: YAGEO; Manufacturer PN: CC1206KKX7RDBB102; PN: 302011962; Temperature Coefficient: X7R; CLASS: DISCRETE; SIGNAL_MODEL: DEFAULT_CAPACITOR_1000pF_1_2; PCB Footprint: C1206; Package Size: 1206; Dielectric Type: Ceramic; Tolerance: 10%
C110 = CC: CAP, Ceramic, SMD, 100uF, 20%, 10V, 1206; Part Reference: C110; Manufacturer PN: C3216X5R1A107M160AC; Manufacturer: TDK; Company Part Status: BeagleBone Carrier Board; CLASS: DISCRETE; Temperature Coefficient: X5R; PN: 302010747; PCB Footprint: C1206; Tolerance: 20%; Dielectric Type: Ceramic; Package Size: 1206
C111 = CC: CAP, Ceramic, SMD, 10uF, 10%, 10V, 0603; Part Reference: C111; Company Part Status: BeagleBone Carrier Board; Manufacturer: YAGEO; Manufacturer PN: CC0603KRX5R6BB106; PN: 302010103; Temperature Coefficient: X5R; CLASS: DISCRETE; PCB Footprint: C0603; Package Size: 0603; Dielectric Type: Ceramic; Tolerance: 10%
C130 = CC: CAP, Ceramic, SMD, 100nF, 10%, 10V, 0201; Part Reference: C130; Company Part Status: ODYSSEY-i.MX8M; Manufacturer: YAGEO; Manufacturer PN: CC0201KRX5R6BB104; PN: 302010271; Temperature Coefficient: X5R; CLASS: DISCRETE; PCB Footprint: C0201; Package Size: 0201; Dielectric Type: Ceramic; Tolerance: 10%
C131 = CC: CAP, Ceramic, SMD, 100nF, 10%, 10V, 0201; Part Reference: C131; Manufacturer PN: CC0201KRX5R6BB104; Manufacturer: YAGEO; Company Part Status: ODYSSEY-i.MX8M; CLASS: DISCRETE; Temperature Coefficient: X5R; PN: 302010271; PCB Footprint: C0201; Tolerance: 10%; Dielectric Type: Ceramic; Package Size: 0201
D24 = DIODE TVS BI-DIR: DIO, ESD, TPD1E1B04DPY, --, 3.6V, --, X1SON(2); Part Reference: D24; Manufacturer: TI; Manufacturer Part Number: TPD1E1B04DPYR/T; Company Part Status: Grove Base Cape for PocketBeagle; Manufacturer PN: TPD1E1B04DPYR; PN: 304050798; CLASS: DISCRETE; PCB Footprint: D0402; Part Type: ESD; Status: Grove Base Cape for PocketBeagle; Temperature: -40¡ãC to 125¡ãC
D25 = DIODE TVS BI-DIR: DIO, ESD, TPD1E1B04DPY, --, 3.6V, --, X1SON(2); Part Reference: D25; Manufacturer: TI; Manufacturer Part Number: TPD1E1B04DPYR/T; Company Part Status: Grove Base Cape for PocketBeagle; Manufacturer PN: TPD1E1B04DPYR; PN: 304050798; CLASS: DISCRETE; PCB Footprint: D0402; Part Type: ESD; Status: Grove Base Cape for PocketBeagle; Temperature: -40¡ãC to 125¡ãC
J13 = Single USB A_180D: CONN, USB, 4P, DIP; Part Reference: J13; Company Part Status: SCG Vehicle Device; Manufacturer: SUNGTECH; PN: 320010495; CLASS: IO; Package Size: 4P-2.0-Side; Manufacturer PN: ST-USB-117A
J14 = USB2.0_Type C_16+6P#1: CONN, USB, TYPE-C 2.0, 16+6, SMD; Part Reference: J14; Manufacturer: MTCONN; Manufacturer PN: UBF31-0171; PN: 320010943; Contact Voltage: 30 V; CLASS: IO; PCB Footprint: USB2_0_TYPE_C; Package Size: 8.94 x 7.55 mm
L4 = CL: Common Mode Filter, 90R, , 400mA, 2.0x1.2 mm; Part Reference: L4; Manufacturer PN: SRF2012-900YA; Company Part Status: BeagleBone Carrier Board; Manufacturer: Bourns; CLASS: DISCRETE; PN: 303050063; Priority: A; PCB Footprint: L2012; Part Type: Common Mode Filter; Status: BeagleBone AI TDA4VM; Temperature: -40¡ãC to 85¡ãC
L13 = CL: Common Mode Filter, 90R, , 400mA, 2.0x1.2 mm; Part Reference: L13; Manufacturer: Bourns; Company Part Status: BeagleBone Carrier Board; Manufacturer PN: SRF2012-900YA; Priority: A; PN: 303050063; CLASS: DISCRETE; PCB Footprint: L2012; Temperature: -40¡ãC to 85¡ãC; Status: BeagleBone AI TDA4VM; Part Type: Common Mode Filter
MH1 = MHole: MISC, Mhole, Hole 3d125MM, DIP, 4D5MM; Part Reference: MH1; Company Part Status: MS; CLASS: DISCRETE; PN: Mhole001; PCB Footprint: PTH_3_125mm_5
MH2 = MHole: MISC, Mhole, Hole 3d125MM, DIP, 4D5MM; Part Reference: MH2; Company Part Status: MS; CLASS: DISCRETE; PN: Mhole001; PCB Footprint: PTH_3_125mm_5
MH3 = MHole: MISC, Mhole, Hole 3d125MM, DIP, 4D5MM; Part Reference: MH3; Company Part Status: MS; PN: Mhole001; CLASS: DISCRETE; PCB Footprint: PTH_3_125mm_5
MH4 = MHole: MISC, Mhole, Hole 3d125MM, DIP, 4D5MM; Part Reference: MH4; Company Part Status: MS; PN: Mhole001; CLASS: DISCRETE; PCB Footprint: PTH_3_125mm_5
R38 = R: RES, Thick Film, 1M, 1%, 1/4W, SMD, 1206; Part Reference: R38; Company Part Status: Sensecap Gateway V1; Manufacturer: YAGEO; Manufacturer PN: RC1206FR-071ML; PN: 301010410; CLASS: DISCRETE; SIGNAL_MODEL: DEFAULT_RESISTOR_0.001OHM_1_2; PCB Footprint: R1206; Package Size: 1206; Rated Power: 1/4W
R94 = R: RES, Thick Film, 10K, 1%, 1/16W, SMD, 0402; Part Reference: R94; Company Part Status: BeagleBone Carrier Board; Manufacturer: YAGEO; Manufacturer PN: RC0402FR-0710KL; PN: 301010047; CLASS: DISCRETE; PCB Footprint: R0402; Package Size: 0402; Rated Power: 1/16W
R128 = R: RES, Thick Film, 5.1K, 1%, 1/16W, SMD, 0402; Part Reference: R128; Company Part Status: Geni; Manufacturer: YAGEO; Manufacturer PN: RC0402FR-075K1L; PN: 301010495; CLASS: DISCRETE; PCB Footprint: R0402; Package Size: 0402; Rated Power: 1/16W
R129 = R: RES, Thick Film, 5.1K, 1%, 1/16W, SMD, 0402; Part Reference: R129; Company Part Status: Geni; Manufacturer: YAGEO; Manufacturer PN: RC0402FR-075K1L; PN: 301010495; CLASS: DISCRETE; PCB Footprint: R0402; Package Size: 0402; Rated Power: 1/16W
R130 = R: RES, Thick Film, 499R, 0.1%, 1/16W, SMD, 0402; Part Reference: R130; Manufacturer PN: RT0402BRE07499RL; Manufacturer: YAGEO; Company Part Status: Beaglebone LoRa Gateway; CLASS: DISCRETE; PN: 301010848; PCB Footprint: R0402; Rated Power: 1/16W; Package Size: 0402
R131 = R: RES, Thick Film, 499R, 0.1%, 1/16W, SMD, 0402; Part Reference: R131; Manufacturer PN: RT0402BRE07499RL; Manufacturer: YAGEO; Company Part Status: Beaglebone LoRa Gateway; CLASS: DISCRETE; PN: 301010848; PCB Footprint: R0402; Rated Power: 1/16W; Package Size: 0402
R132 = R: RES, Thick Film, 20K, 1%, 1/16W, SMD, 0402; Part Reference: R132; Company Part Status: Grove Base Cape for PocketBeagle; Manufacturer: YAGEO; Manufacturer PN: RC0402FR-0720KL; PN: 301010072; CLASS: DISCRETE; PCB Footprint: R0402; Package Size: 0402; Rated Power: 1/16W
R133 = R: RES, Thick Film, 1K, 1%, 1/16W, SMD, 0402; Part Reference: R133; Manufacturer PN: RC0402FR-071KL; Manufacturer: YAGEO; Company Part Status: Combox Pro; CLASS: DISCRETE; PN: 301010044; PCB Footprint: R0402; Rated Power: 1/16W; Package Size: 0402
R136 = R: RES, Thick Film, 20K, 1%, 1/16W, SMD, 0402; Part Reference: R136; Company Part Status: Grove Base Cape for PocketBeagle; Manufacturer: YAGEO; Manufacturer PN: RC0402FR-0720KL; PN: 301010072; CLASS: DISCRETE; PCB Footprint: R0402; Package Size: 0402; Rated Power: 1/16W
R152 = R: RES, Thick Film, 10K, 1%, 1/16W, SMD, 0402; Part Reference: R152; Company Part Status: BeagleBone Carrier Board; Manufacturer: YAGEO; Manufacturer PN: RC0402FR-0710KL; PN: 301010047; CLASS: DISCRETE; PCB Footprint: R0402; Package Size: 0402; Rated Power: 1/16W
U1 = AM62x_BGA425: IC, Controller, MPU, AM62x, BGA425; Part Reference: U1; Manufacturer PN: AM6254ATCGGHALWR; Manufacturer: TI; Company Part Status: BeaglePlay; PN: 310011537; PCB Footprint: bga425_0d5_13x13mm; CLASS: IC
U4 = TVS0500DRVR: DIO, TVS, TVS0500DRVR, --, 5V, --, SON-6(2x2); Part Reference: U4; Company Part Status: BeaglePlay; Manufacturer: TI; PN: 304051039; CLASS: DISCRETE; PCB Footprint: WSON6_0d65_2x2x0_8mm; Manufacturer PN: TVS0500DRVR
U8 = TPD3S014D_SOT23-6: IC, PMIC, Power Switch, TPD3S014DBVR, SOT23-6; Part Reference: U8; Manufacturer: TI; Company Part Status: BeaglePlay; PN: 310032515; PCB Footprint: sot23_6; Manufacturer PN: TPD3S014DBVR; CLASS: IC

## Sheet 016_SoC Reset & MCU.SchDoc
size 420 x 297 mm; Page Create Date: May 29, 2006; WebSite: https://www.seeedstudio.com; Variant Name: <Core Design>; Page Number: 16; Drawing: qxn; Schematic Name: BeaglePlay; Page Size: A3; Comment: Seeed Title; Page Count: 22; Page Name: 016_SoC Reset & MCU; Company: Seeed Studio; RevCode: v0.2; DsnPath: C:\Users\a0488739\Documents\GitHub\beagleplay\allegro\DVT\BEAGLEPLAYV020_220915.DSN; SchematicName: BeaglePlay; PageName: 016_SoC Reset & MCU; PageSize: A3; TopSchematic: True
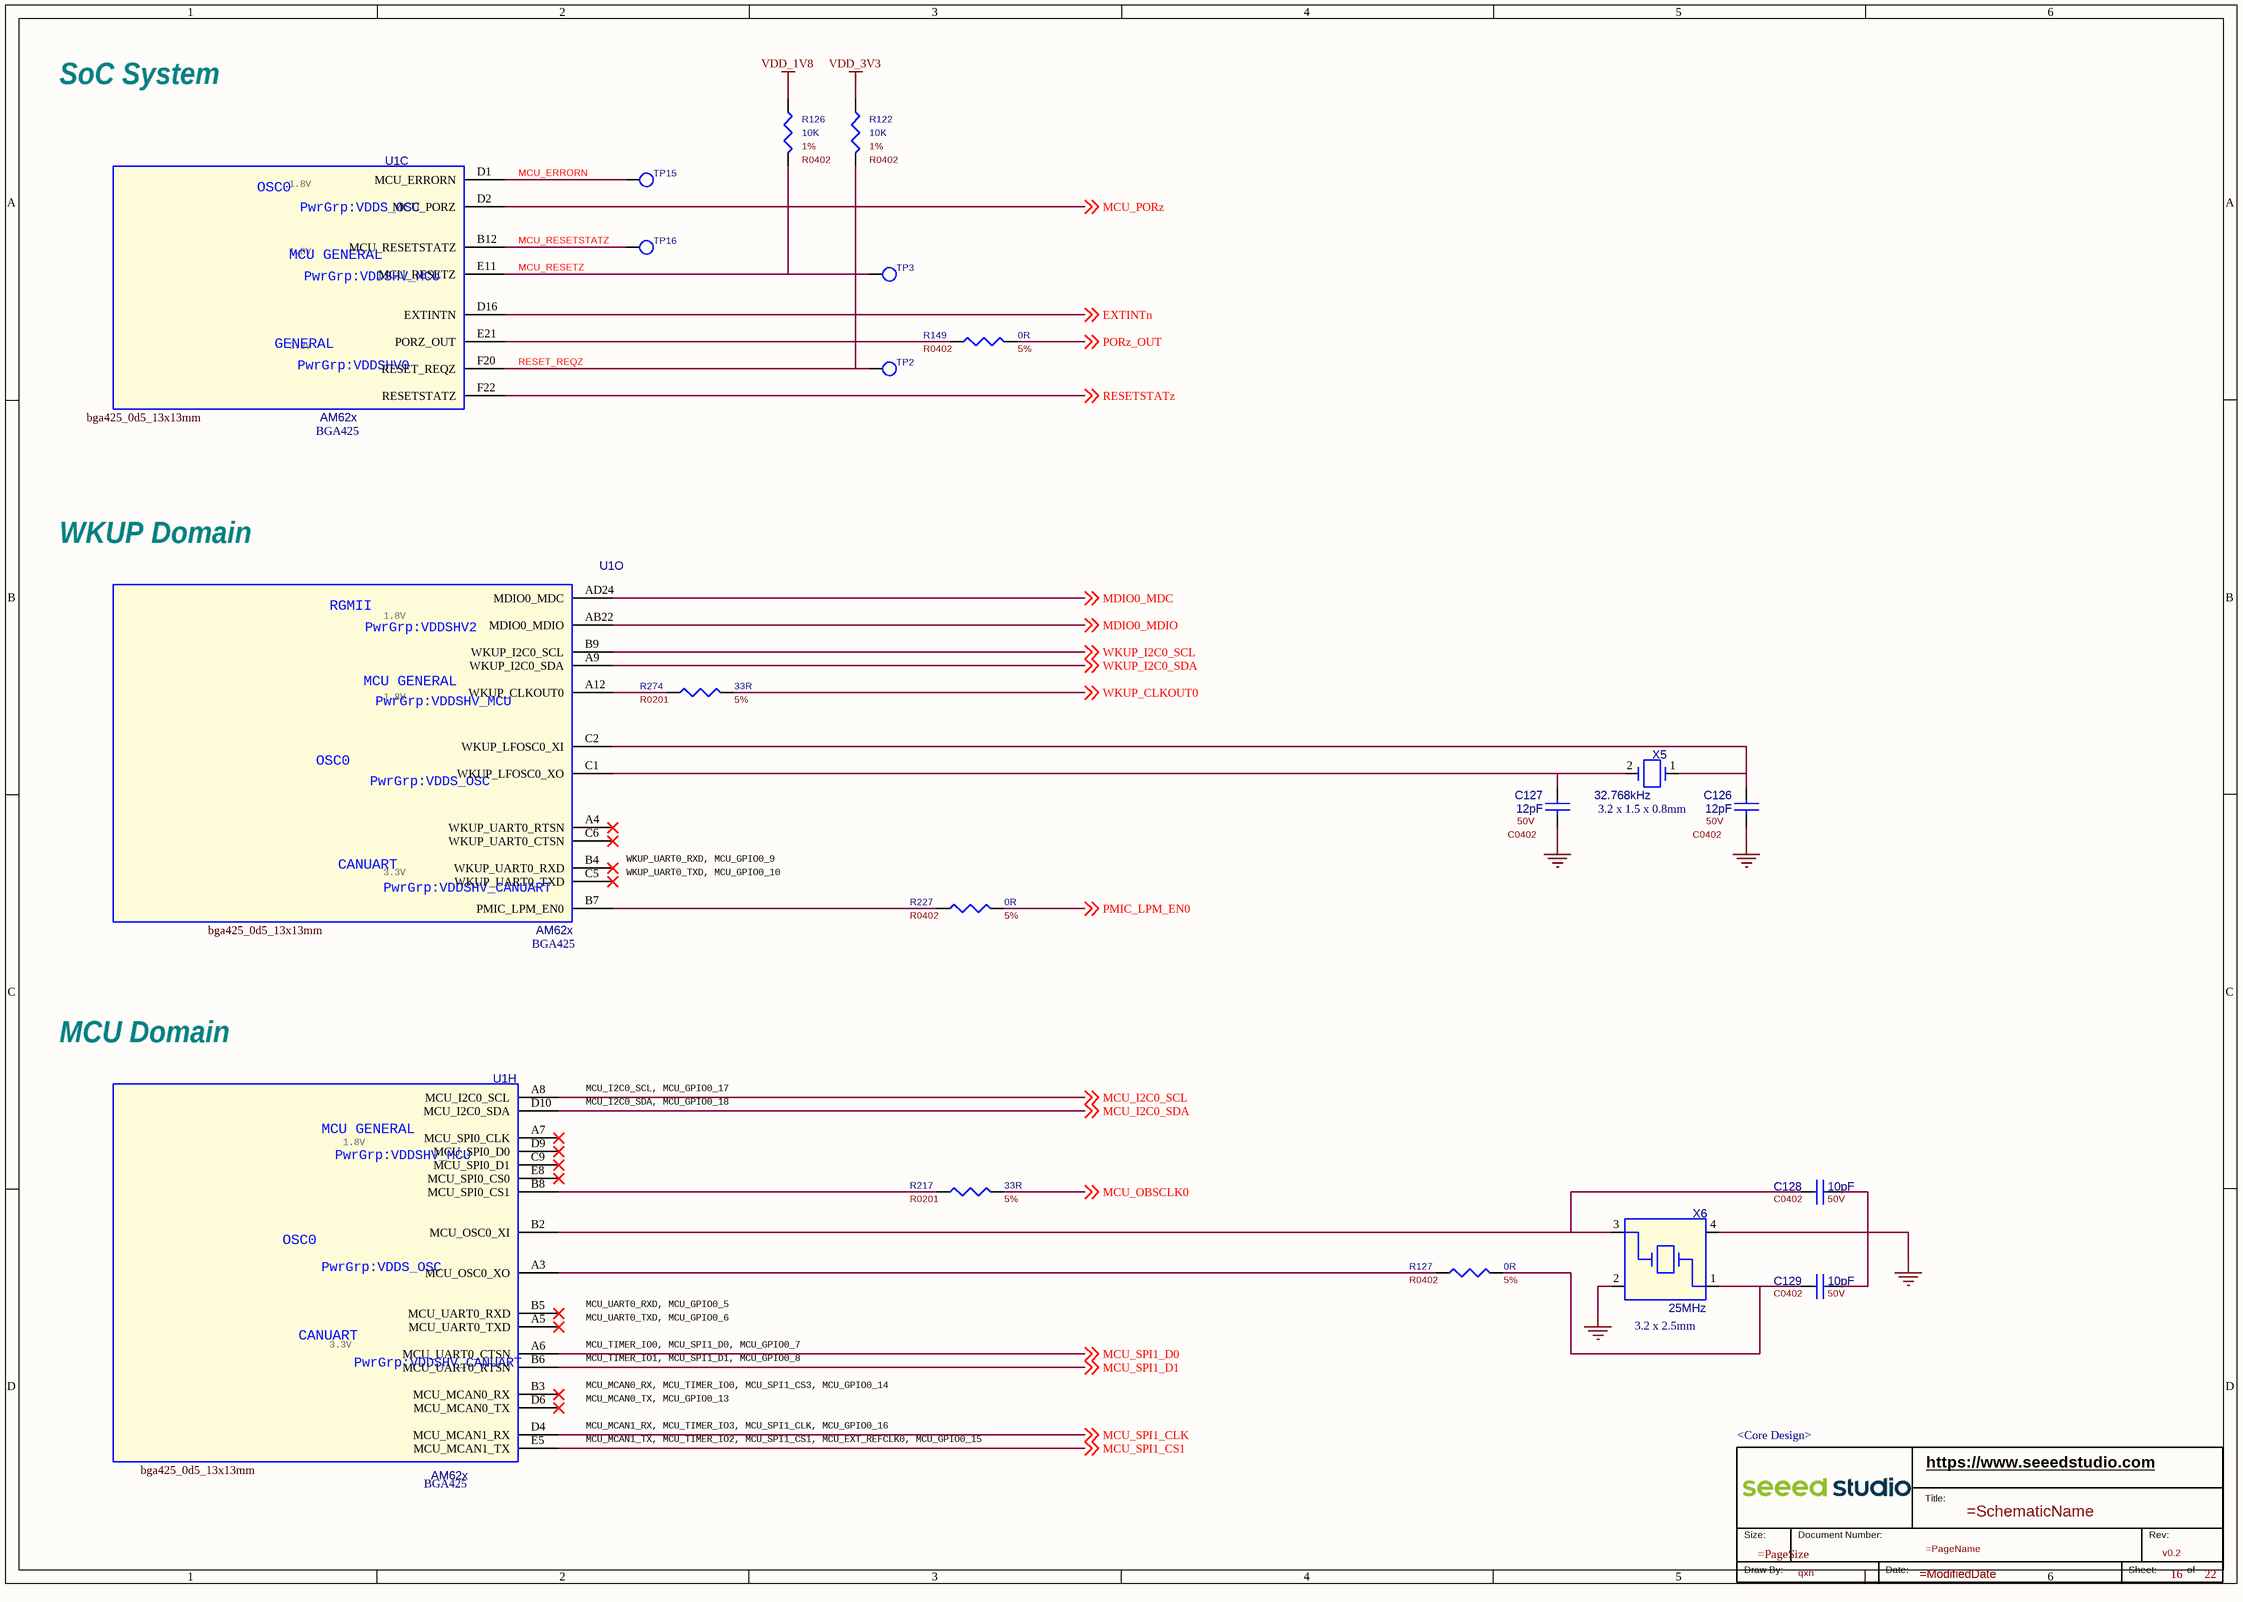
[diagram p15: 016_SoC Reset & MCU.SchDoc]

### Parts
(Parts that share a designator on the sheet are numbered #1, #2 ... from top to bottom, then left to right.)
*#16  RevCode: v0.2  Page Number: 16  Page Count: 22  Drawing: qxn  Variant Name: <Core Design>  (hidden comment: Seeed Title)  (graphical)
C126  value 12pF  Rating: 50V  [C0402]  (hidden comment: CC)
C127  value 12pF  Rating: 50V  [C0402]  (hidden comment: CC)
C128  value 10pF  Rating: 50V  [C0402]  (hidden comment: CC)
C129  value 10pF  Rating: 50V  [C0402]  (hidden comment: CC)
R122  value 10K  Rating: 1%  [R0402]  (hidden comment: R)
R126  value 10K  Rating: 1%  [R0402]  (hidden comment: R)
R127  value 0R  Rating: 5%  [R0402]  (hidden comment: R)
R149  value 0R  Rating: 5%  [R0402]  (hidden comment: R)
R217  value 33R  Rating: 5%  [R0201]  (hidden comment: R)
R227  value 0R  Rating: 5%  [R0402]  (hidden comment: R)
R274  value 33R  Rating: 5%  [R0201]  (hidden comment: R)
TP2  Test Point  [tp1-8040]  (value not drawn)
TP3  Test Point  [tp1-8040]  (value not drawn)
TP15  Test Point  [tp1-8040]  (value not drawn)
TP16  Test Point  [tp1-8040]  (value not drawn)
U1  value AM62x  Package Size: BGA425  [bga425_0d5_13x13mm]  (hidden comment: AM62x_BGA425)  (parts C,H,O of 19)
X5  value 32.768kHz  Package Size: 3.2 x 1.5 x 0.8mm  [X2_SMD_3_2X1_5MM]  (hidden comment: XTAL_2P)
X6  value 25MHz  Package Size: 3.2 x 2.5mm  [X4-SMD-3_2X2_5X1_0MM]  (hidden comment: XTAL_4P)

### Nets
GND: C126.2 C127.2 C128.2 C129.2 X6.2 X6.4
VDD_1V8: R126.1
VDD_3V3: R122.1
EXTINTn: U1.D16(EXTINTN) ; off-sheet EXTINTn
MCU_ERRORN: TP15.1(TP) U1.D1(MCU_ERRORN)
MCU_I2C0_SCL: U1.A8(MCU_I2C0_SCL) ; off-sheet MCU_I2C0_SCL
MCU_I2C0_SDA: U1.D10(MCU_I2C0_SDA) ; off-sheet MCU_I2C0_SDA
MCU_OBSCLK0: R217.2 ; off-sheet MCU_OBSCLK0
MCU_PORz: U1.D2(MCU_PORZ) ; off-sheet MCU_PORz
MCU_RESETSTATZ: TP16.1(TP) U1.B12(MCU_RESETSTATZ)
MCU_RESETZ: R126.2 TP3.1(TP) U1.E11(MCU_RESETZ)
MCU_SPI1_CLK: U1.D4(MCU_MCAN1_RX) ; off-sheet MCU_SPI1_CLK
MCU_SPI1_CS1: U1.E5(MCU_MCAN1_TX) ; off-sheet MCU_SPI1_CS1
MCU_SPI1_D0: U1.A6(MCU_UART0_CTSN) ; off-sheet MCU_SPI1_D0
MCU_SPI1_D1: U1.B6(MCU_UART0_RTSN) ; off-sheet MCU_SPI1_D1
MDIO0_MDC: U1.AD24(MDIO0_MDC) ; off-sheet MDIO0_MDC  [project net MDC]
MDIO0_MDIO: U1.AB22(MDIO0_MDIO) ; off-sheet MDIO0_MDIO  [project net MDIO]
PMIC_LPM_EN0: R227.2 ; off-sheet PMIC_LPM_EN0
PORz_OUT: R149.2 ; off-sheet PORz_OUT
RESET_REQZ: R122.2 TP2.1(TP) U1.F20(RESET_REQZ)
RESETSTATz: U1.F22(RESETSTATZ) ; off-sheet RESETSTATz
WKUP_CLKOUT0: R274.2 ; off-sheet WKUP_CLKOUT0
WKUP_I2C0_SCL: U1.B9(WKUP_I2C0_SCL) ; off-sheet WKUP_I2C0_SCL
WKUP_I2C0_SDA: U1.A9(WKUP_I2C0_SDA) ; off-sheet WKUP_I2C0_SDA
NetC126_1: C126.1 U1.C2(WKUP_LFOSC0_XI) X5.1
NetC127_1: C127.1 U1.C1(WKUP_LFOSC0_XO) X5.2
NetC128_1: C128.1 U1.B2(MCU_OSC0_XI) X6.3
NetC129_1: C129.1 R127.2 X6.1
NetR127_1: R127.1 U1.A3(MCU_OSC0_XO)
NetR149_1: R149.1 U1.E21(PORZ_OUT)
NetR217_1: R217.1 U1.B8(MCU_SPI0_CS1)
NetR227_1: R227.1 U1.B7(PMIC_LPM_EN0)
NetR274_1: R274.1 U1.A12(WKUP_CLKOUT0)

Not connected (* = marked no-connect by the designer): U1 A4(WKUP_UART0_RTSN)* A5(MCU_UART0_TXD)* A7(MCU_SPI0_CLK)* B3(MCU_MCAN0_RX)* B4(WKUP_UART0_RXD)* B5(MCU_UART0_RXD)* C5(WKUP_UART0_TXD)* C6(WKUP_UART0_CTSN)* C9(MCU_SPI0_D1)* D6(MCU_MCAN0_TX)* D9(MCU_SPI0_D0)* E8(MCU_SPI0_CS0)*

### Notes on the sheet
- SoC System
- 1.8V
- 3.3V
- WKUP Domain
- WKUP_UART0_RXD, MCU_GPIO0_9
- WKUP_UART0_TXD, MCU_GPIO0_10
- MCU Domain
- MCU_I2C0_SCL, MCU_GPIO0_17
- MCU_I2C0_SDA, MCU_GPIO0_18
- MCU_UART0_RXD, MCU_GPIO0_5
- MCU_UART0_TXD, MCU_GPIO0_6
- MCU_TIMER_IO1, MCU_SPI1_D1, MCU_GPIO0_8
- MCU_TIMER_IO0, MCU_SPI1_D0, MCU_GPIO0_7
- MCU_MCAN0_RX, MCU_TIMER_IO0, MCU_SPI1_CS3, MCU_GPIO0_14
- MCU_MCAN0_TX, MCU_GPIO0_13
- MCU_MCAN1_TX, MCU_TIMER_IO2, MCU_SPI1_CS1, MCU_EXT_REFCLK0, MCU_GPIO0_15
- MCU_MCAN1_RX, MCU_TIMER_IO3, MCU_SPI1_CLK, MCU_GPIO0_16
- (in symbol AM62x_BGA425, part C) OSC0; PwrGrp:VDDS_OSC; MCU GENERAL; PwrGrp:VDDSHV_MCU; GENERAL; PwrGrp:VDDSHV0
- (in symbol AM62x_BGA425, part H) MCU GENERAL; PwrGrp:VDDSHV_MCU; OSC0; PwrGrp:VDDS_OSC; CANUART; PwrGrp:VDDSHV_CANUART
- (in symbol AM62x_BGA425, part O) RGMII; PwrGrp:VDDSHV2; MCU GENERAL; PwrGrp:VDDSHV_MCU; OSC0; PwrGrp:VDDS_OSC; CANUART; PwrGrp:VDDSHV_CANUART
- (in symbol Seeed Title) https://www.seeedstudio.com; Title:; Size:; Document Number:; Rev:; Draw By:; Date:; Sheet:; of

### Library data of the parts
*#16 = Seeed Title: Company: Seeed Studio; WebSite: https://www.seeedstudio.com; Schematic Name: =SchematicName; Page Size: =PageSize; Page Name: =PageName; Page Create Date: May 29, 2006; Page Modify Date: =ModifiedDate
C126 = CC: CAP, Ceramic, SMD, 12pF, 5%, 50V, 0402; Part Reference: C126; Manufacturer Part Number: CC0402JRNPO9BN120; Manufacturer: YAGEO; Company Part Status: BeaglePlay; PN: 302010049; Temperature Coefficient: NPO; CLASS: DISCRETE; PCB Footprint: C0402; Temperature: -55¡ãC to 125¡ãC; Status: Testo PoE; Part Type: Ceramic; Package Size: 0402; Dielectric Type: Ceramic; Tolerance: 5%; Manufacturer PN: CC0402JRNPO9BN120
C127 = CC: CAP, Ceramic, SMD, 12pF, 5%, 50V, 0402; Part Reference: C127; Manufacturer PN: CC0402JRNPO9BN120; Company Part Status: BeaglePlay; Manufacturer: YAGEO; CLASS: DISCRETE; Temperature Coefficient: NPO; PN: 302010049; PCB Footprint: C0402; Tolerance: 5%; Dielectric Type: Ceramic; Package Size: 0402; Temperature: -55¡ãC to 125¡ãC; Status: Testo PoE; Part Type: Ceramic; Manufacturer Part Number: CC0402JRNPO9BN120
C128 = CC: CAP, Ceramic, SMD, 10pF, 5%, 50V, 0402; Part Reference: C128; Manufacturer PN: CC0402JRNPO9BN100; Manufacturer: YAGEO; Company Part Status: BeagleBone Carrier Board; CLASS: DISCRETE; Temperature Coefficient: NPO; PN: 302010001; PCB Footprint: C0402; Tolerance: 5%; Dielectric Type: Ceramic; Package Size: 0402
C129 = CC: CAP, Ceramic, SMD, 10pF, 5%, 50V, 0402; Part Reference: C129; Manufacturer PN: CC0402JRNPO9BN100; Manufacturer: YAGEO; Company Part Status: BeagleBone Carrier Board; CLASS: DISCRETE; Temperature Coefficient: NPO; PN: 302010001; PCB Footprint: C0402; Tolerance: 5%; Dielectric Type: Ceramic; Package Size: 0402
R122 = R: RES, Thick Film, 10K, 1%, 1/16W, SMD, 0402; Part Reference: R122; Manufacturer PN: RC0402FR-0710KL; Manufacturer: YAGEO; Company Part Status: BeagleBone Carrier Board; CLASS: DISCRETE; PN: 301010047; PCB Footprint: R0402; Rated Power: 1/16W; Package Size: 0402
R126 = R: RES, Thick Film, 10K, 1%, 1/16W, SMD, 0402; Part Reference: R126; Manufacturer PN: RC0402FR-0710KL; Manufacturer: YAGEO; Company Part Status: BeagleBone Carrier Board; CLASS: DISCRETE; PN: 301010047; PCB Footprint: R0402; Rated Power: 1/16W; Package Size: 0402
R127 = R: RES, Thick Film, 0R, 5%, 1/16W, SMD, 0402; Part Reference: R127; Manufacturer PN: RC0402JR-070RL; Manufacturer: YAGEO; Company Part Status: BeagleBone Carrier Board; CLASS: DISCRETE; PN: 301010000; PCB Footprint: R0402; Rated Power: 1/16W; Package Size: 0402
R149 = R: RES, Thick Film, 0R, 5%, 1/16W, SMD, 0402; Part Reference: R149; Company Part Status: BeagleBone Carrier Board; Manufacturer: YAGEO; Manufacturer PN: RC0402JR-070RL; PN: 301010000; CLASS: DISCRETE; PCB Footprint: R0402; Package Size: 0402; Rated Power: 1/16W
R217 = R: RES, Thick Film, 33R, 5%, 1/20W, SMD, 0201; Part Reference: R217; Manufacturer PN: RC0201JR-0733RL; Manufacturer: YAGEO; Company Part Status: BeagleBone Carrier Board; CLASS: DISCRETE; PN: 301010675; PCB Footprint: R0201; Rated Power: 1/20W; Package Size: 0201
R227 = R: RES, Thick Film, 0R, 5%, 1/16W, SMD, 0402; Part Reference: R227; Manufacturer PN: RC0402JR-070RL; Manufacturer: YAGEO; Company Part Status: BeagleBone Carrier Board; CLASS: DISCRETE; PN: 301010000; PCB Footprint: R0402; Rated Power: 1/16W; Package Size: 0402
R274 = R: RES, Thick Film, 33R, 5%, 1/20W, SMD, 0201; Part Reference: R274; Manufacturer PN: RC0201JR-0733RL; Manufacturer: YAGEO; Company Part Status: BeagleBone Carrier Board; CLASS: DISCRETE; PN: 301010675; PCB Footprint: R0201; Rated Power: 1/20W; Package Size: 0201
TP2 = Test Point: MISC, Test Point, Test Point, SMD, TP35S_SMD; Part Reference: TP2; Company Part Status: Mini-Gateway; ASSY: DNP; CLASS: DISCRETE; PCB Footprint: TP35S_SMD; Value: Test Point; Package Size: TP35S_SMD; PN: TP35S_SMD
TP3 = Test Point: MISC, Test Point, Test Point, SMD, TP35S_SMD; Part Reference: TP3; Company Part Status: Mini-Gateway; ASSY: DNP; CLASS: DISCRETE; PCB Footprint: TP35S_SMD; Value: Test Point; PN: TP35S_SMD; Package Size: TP35S_SMD
TP15 = Test Point: MISC, Test Point, Test Point, SMD, TP35S_SMD; Part Reference: TP15; Company Part Status: Mini-Gateway; ASSY: DNP; CLASS: DISCRETE; PCB Footprint: TP35S_SMD; Value: Test Point; PN: TP35S_SMD; Package Size: TP35S_SMD
TP16 = Test Point: MISC, Test Point, Test Point, SMD, TP35S_SMD; Part Reference: TP16; Company Part Status: Mini-Gateway; ASSY: DNP; CLASS: DISCRETE; PCB Footprint: TP35S_SMD; Value: Test Point; Package Size: TP35S_SMD; PN: TP35S_SMD
U1 = AM62x_BGA425: as U1 on sheet 015_SoC USB & USB_A & USB_C; PCB Footprint: bga425_0d5_13x13mm; CLASS: IC
X5 = XTAL_2P: Crystal, SMD, 32.768kHz, 20 ppm, 7pF; Part Reference: X5; Manufacturer PN: FC-135 32.768KA-AG0; Company Part Status: Combox Pro; Manufacturer: EPSON; CLASS: DISCRETE; Frequency Tolerance: 20 ppm; Rating: 20ppm; PN: 306011026; PCB Footprint: X2_SMD_3_2X1_5MM; Temperature: -40¡ãC to 85¡ãC; Status: Zola Dongle; Part Type: Crystal; Manufacturer Part Number: FC-135 32.768KA-AG0
X6 = XTAL_4P: Crystal, SMD, 25MHz, 10 ppm, 8pF; Part Reference: X6; Company Part Status: RV PI; Manufacturer: Interquip; Manufacturer PN: 5YAA25000081TF30Q2; PN: 306011162; Frequency Tolerance: 10 ppm; CLASS: DISCRETE; PCB Footprint: X4-SMD-3_2X2_5X1_0MM